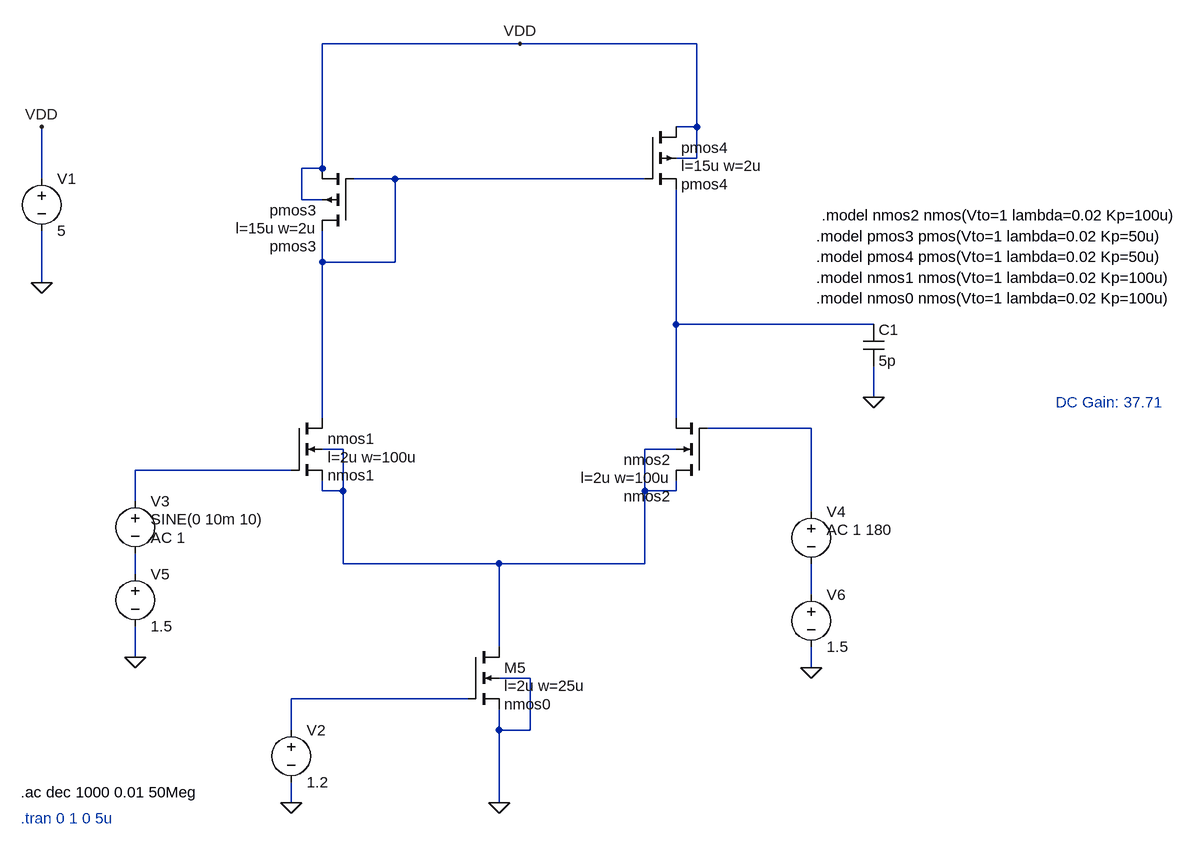
[diagram p0: schematic one stage opamp.asc]
one stage opamp.asc, the LTspice schematic file:
Version 4.1
SHEET 1 1636 1032
WIRE 336 -176 32 -176
WIRE 608 -176 336 -176
WIRE 608 -48 608 -176
WIRE 608 -48 576 -48
WIRE 608 0 608 -48
WIRE 608 0 576 0
WIRE 32 16 32 -176
WIRE 32 16 0 16
WIRE -400 32 -400 -48
WIRE 144 32 80 32
WIRE 528 32 144 32
WIRE 0 64 0 16
WIRE 32 64 0 64
WIRE 32 160 32 112
WIRE 144 160 144 32
WIRE 144 160 32 160
WIRE -400 192 -400 112
WIRE 576 256 576 48
WIRE 880 256 576 256
WIRE 880 368 880 320
WIRE 32 400 32 160
WIRE 576 400 576 256
WIRE 784 416 624 416
WIRE 64 448 32 448
WIRE 576 448 528 448
WIRE -16 480 -256 480
WIRE 32 512 32 496
WIRE 64 512 64 448
WIRE 64 512 32 512
WIRE 528 512 528 448
WIRE 576 512 576 496
WIRE 576 512 528 512
WIRE -256 528 -256 480
WIRE 784 544 784 416
WIRE 64 624 64 512
WIRE 304 624 64 624
WIRE 528 624 528 512
WIRE 528 624 304 624
WIRE -256 640 -256 608
WIRE 784 672 784 624
WIRE 304 752 304 624
WIRE -256 768 -256 720
WIRE 784 784 784 752
WIRE 352 800 304 800
WIRE 256 832 -16 832
WIRE -16 880 -16 832
WIRE 304 880 304 848
WIRE 352 880 352 800
WIRE 352 880 304 880
WIRE -16 992 -16 960
WIRE 304 992 304 880
FLAG -400 192 0
FLAG -400 -48 VDD
FLAG 336 -176 VDD
FLAG 304 992 0
FLAG -16 992 0
FLAG -256 768 0
FLAG 784 784 0
FLAG 880 368 0
SYMBOL pmos4 80 112 R180
WINDOW 123 56 4 Left 2
WINDOW 3 56 -24 Left 2
SYMATTR Value2 l=15u w=2u
SYMATTR Value pmos3
SYMATTR InstName pmos3
SYMBOL pmos4 528 -48 R0
WINDOW 123 56 60 Left 2
WINDOW 3 56 88 Left 2
SYMATTR Value2 l=15u w=2u
SYMATTR Value pmos4
SYMATTR InstName pmos4
SYMBOL nmos4 -16 400 R0
WINDOW 123 56 60 Left 2
WINDOW 3 56 88 Left 2
SYMATTR Value2 l=2u w=100u
SYMATTR Value nmos1
SYMATTR InstName nmos1
SYMBOL nmos4 624 496 R180
WINDOW 123 56 4 Left 2
WINDOW 3 56 -24 Left 2
SYMATTR Value2 l=2u w=100u
SYMATTR Value nmos2
SYMATTR InstName nmos2
SYMBOL nmos4 256 752 R0
WINDOW 123 56 60 Left 2
WINDOW 3 56 88 Left 2
SYMATTR Value2 l=2u w=25u
SYMATTR Value nmos0
SYMATTR InstName M5
SYMBOL voltage -400 16 R0
WINDOW 123 0 0 Left 0
WINDOW 39 0 0 Left 0
SYMATTR InstName V1
SYMATTR Value 5
SYMBOL voltage -16 864 R0
WINDOW 123 0 0 Left 0
WINDOW 39 0 0 Left 0
SYMATTR InstName V2
SYMATTR Value 1.2
SYMBOL voltage -256 512 R0
WINDOW 3 24 44 Left 2
WINDOW 123 24 72 Left 2
WINDOW 39 0 0 Left 0
SYMATTR Value SINE(0 10m 10)
SYMATTR Value2 AC 1
SYMATTR InstName V3
SYMBOL voltage 784 528 R0
WINDOW 3 24 44 Left 2
WINDOW 123 24 44 Left 2
WINDOW 39 0 0 Left 0
SYMATTR Value ""
SYMATTR Value2 AC 1 180
SYMATTR InstName V4
SYMBOL voltage -256 624 R0
WINDOW 123 0 0 Left 0
WINDOW 39 0 0 Left 0
SYMATTR InstName V5
SYMATTR Value 1.5
SYMBOL voltage 784 656 R0
WINDOW 123 0 0 Left 0
WINDOW 39 0 0 Left 0
SYMATTR InstName V6
SYMATTR Value 1.5
SYMBOL cap 864 256 R0
SYMATTR InstName C1
SYMATTR Value 5p
TEXT 792 184 Left 2 !.model nmos1 nmos(Vto=1 lambda=0.02 Kp=100u)
TEXT 792 216 Left 2 !.model nmos0 nmos(Vto=1 lambda=0.02 Kp=100u)
TEXT 792 152 Left 2 !.model pmos4 pmos(Vto=1 lambda=0.02 Kp=50u)
TEXT 792 120 Left 2 !.model pmos3 pmos(Vto=1 lambda=0.02 Kp=50u)
TEXT -432 1016 Left 2 ;.tran 0 1 0 5u
TEXT 800 88 Left 2 !.model nmos2 nmos(Vto=1 lambda=0.02 Kp=100u)
TEXT -432 976 Left 2 !.ac dec 1000 0.01 50Meg
TEXT 1160 376 Left 2 ;DC Gain: 37.71

The netlist it stands for:
* one stage opamp.asc
M§pmos3 N001 N001 VDD VDD pmos3 l=15u w=2u
M§pmos4 VDD N001 N002 VDD pmos4 l=15u w=2u
M§nmos1 N001 N005 N004 N004 nmos1 l=2u w=100u
M§nmos2 N004 N003 N002 N004 nmos2 l=2u w=100u
M5 N004 N008 0 0 nmos0 l=2u w=25u
V1 VDD 0 5
V2 N008 0 1.2
V3 N005 N006 SINE(0 10m 10) AC 1
V4 N003 N007 AC 1 180
V5 N006 0 1.5
V6 N007 0 1.5
C1 N002 0 5p
.model NMOS NMOS
.model PMOS PMOS
.lib standard.mos
.model nmos1 nmos(Vto=1 lambda=0.02 Kp=100u)
.model nmos0 nmos(Vto=1 lambda=0.02 Kp=100u)
.model pmos4 pmos(Vto=1 lambda=0.02 Kp=50u)
.model pmos3 pmos(Vto=1 lambda=0.02 Kp=50u)
* .tran 0 1 0 5u
.model nmos2 nmos(Vto=1 lambda=0.02 Kp=100u)
.ac dec 1000 0.01 50Meg
* DC Gain: 37.71
.backanno
.end